# EAGLE design Mega (EAGLE 7.5.0)
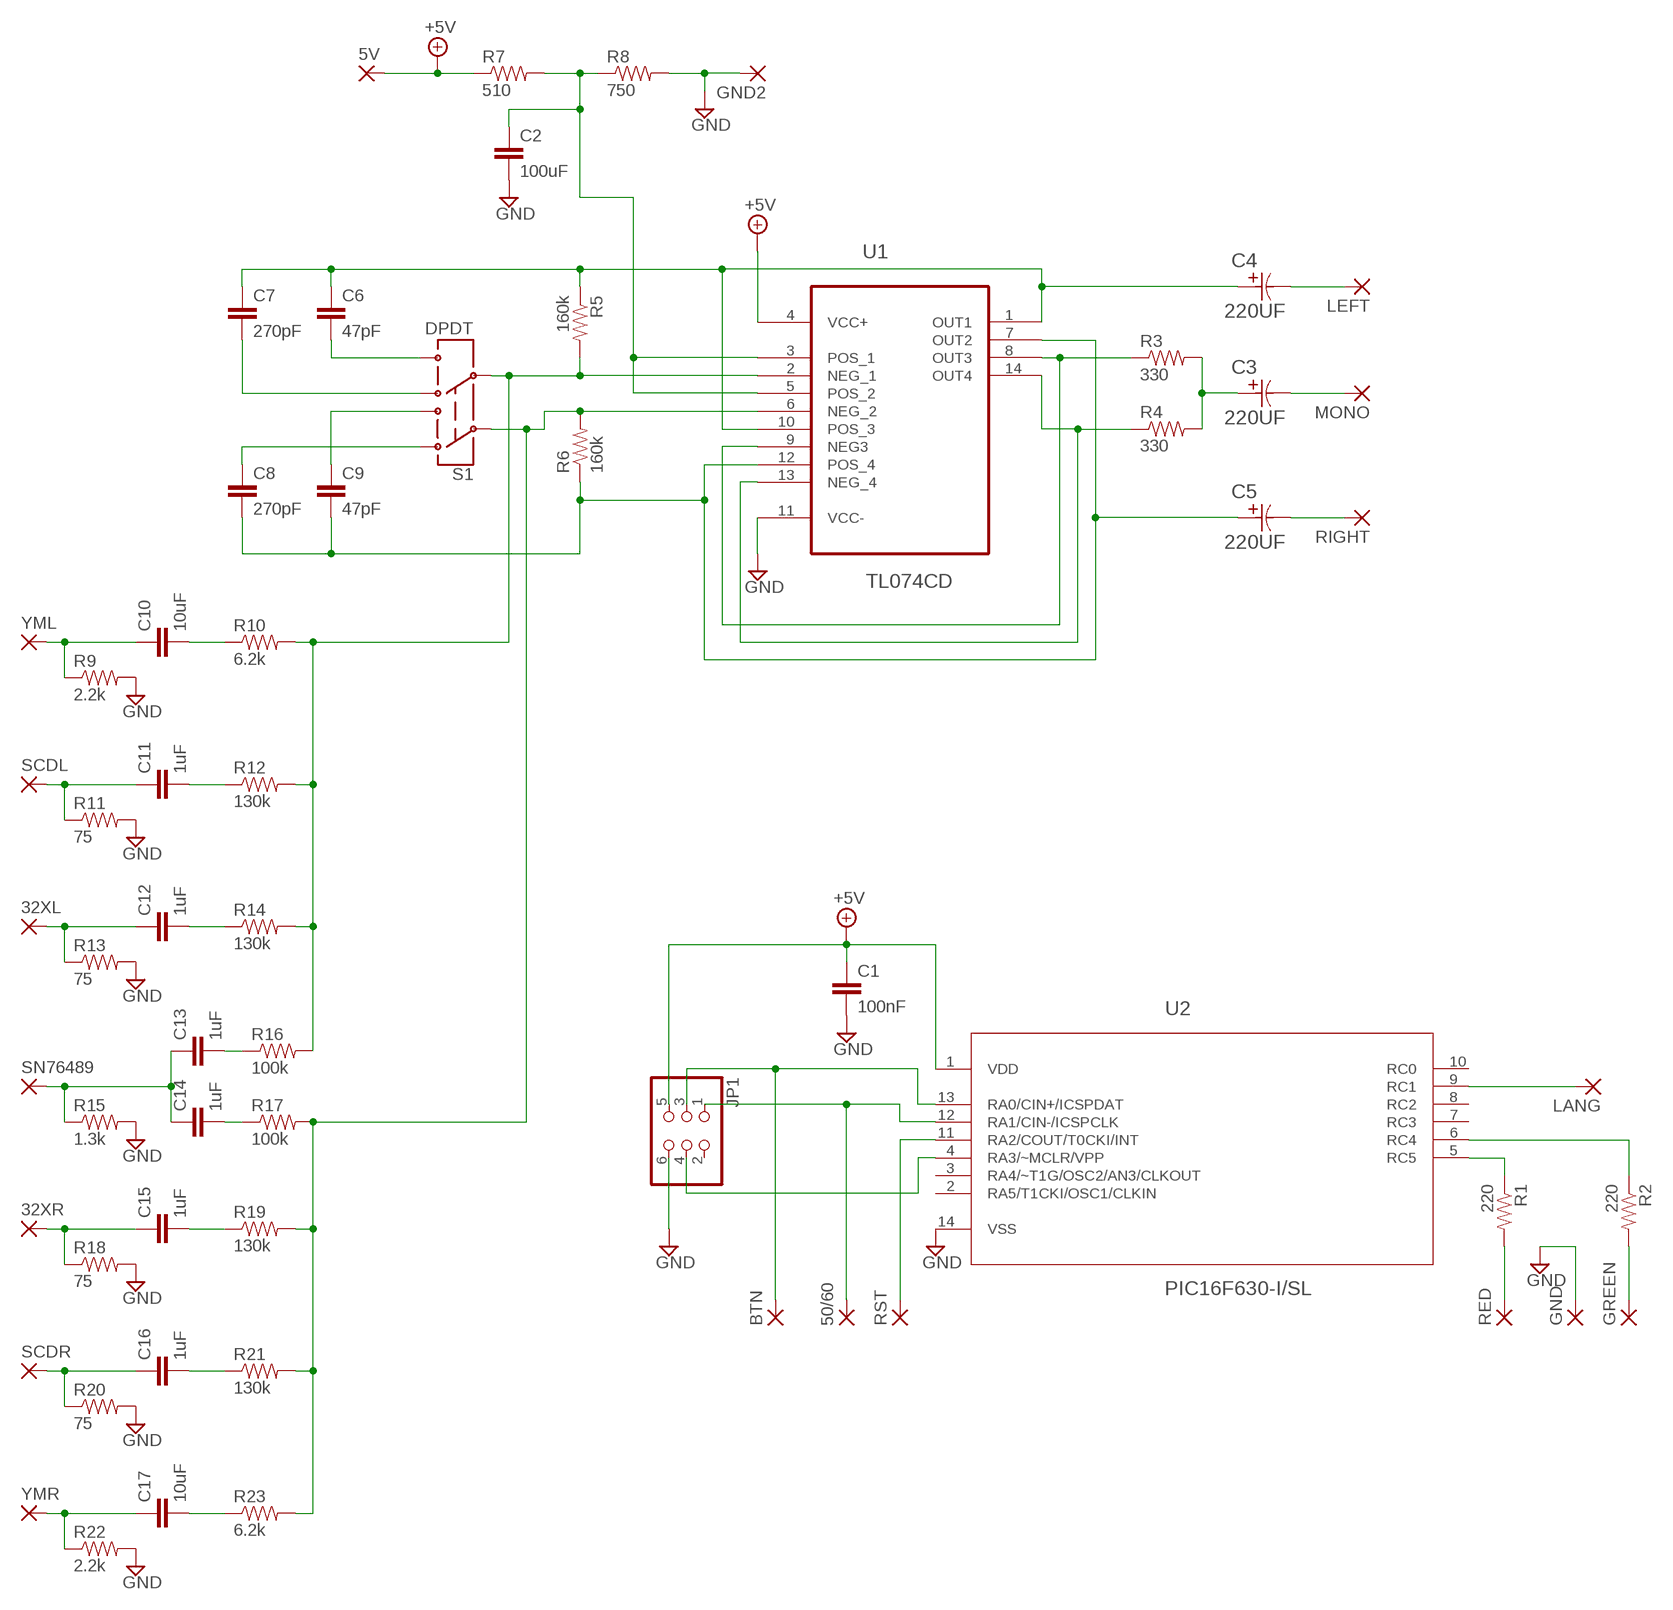
[diagram p0: schematic, sheet 1]

## Parts
5V  SMD2  [SMD1,27-2,54]
32XL  SMD2  [SMD1,27-2,54]
32XR  SMD2  [SMD1,27-2,54]
50/60  SMD2  [SMD1,27-2,54]
BTN  SMD2  [SMD1,27-2,54]
C1  100nF  CAP1206  [1206]
C2  100uF  CAP1206  [1206]
C3  220UF  EEE-FK1C221P-CASE-E  [CAPAE830X650N]
C4  220UF  EEE-FK1C221P-CASE-E  [CAPAE830X650N]
C5  220UF  EEE-FK1C221P-CASE-E  [CAPAE830X650N]
C6  47pF  CAP1206  [1206]
C7  270pF  CAP1206  [1206]
C8  270pF  CAP1206  [1206]
C9  47pF  CAP1206  [1206]
C10  10uF  CAP1206  [1206]
C11  1uF  CAP1206  [1206]
C12  1uF  CAP1206  [1206]
C13  1uF  CAP1206  [1206]
C14  1uF  CAP1206  [1206]
C15  1uF  CAP1206  [1206]
C16  1uF  CAP1206  [1206]
C17  10uF  CAP1206  [1206]
GND  SMD2  [SMD1,27-2,54]
GND2  SMD2  [SMD1,27-2,54]
GREEN  SMD2  [SMD1,27-2,54]
JP1  PINHD-2X3  [2X03]
LANG  SMD2  [SMD1,27-2,54]
LEFT  SMD2  [SMD1,27-2,54]
MONO  SMD2  [SMD1,27-2,54]
R1  220  RESISTOR1206  [1206]
R2  220  RESISTOR1206  [1206]
R3  330  RESISTOR1206  [1206]
R4  330  RESISTOR1206  [1206]
R5  160k  RESISTOR1206  [1206]
R6  160k  RESISTOR1206  [1206]
R7  510  RESISTOR1206  [1206]
R8  750  RESISTOR1206  [1206]
R9  2.2k  RESISTOR1206  [1206]
R10  6.2k  RESISTOR1206  [1206]
R11  75  RESISTOR1206  [1206]
R12  130k  RESISTOR1206  [1206]
R13  75  RESISTOR1206  [1206]
R14  130k  RESISTOR1206  [1206]
R15  1.3k  RESISTOR1206  [1206]
R16  100k  RESISTOR1206  [1206]
R17  100k  RESISTOR1206  [1206]
R18  75  RESISTOR1206  [1206]
R19  130k  RESISTOR1206  [1206]
R20  75  RESISTOR1206  [1206]
R21  130k  RESISTOR1206  [1206]
R22  2.2k  RESISTOR1206  [1206]
R23  6.2k  RESISTOR1206  [1206]
RED  SMD2  [SMD1,27-2,54]
RIGHT  SMD2  [SMD1,27-2,54]
RST  SMD2  [SMD1,27-2,54]
S1  DPDT  SWITCH-DPDTAYZ0202  [AYZ0202]
SCDL  SMD2  [SMD1,27-2,54]
SCDR  SMD2  [SMD1,27-2,54]
SN76489  SMD2  [SMD1,27-2,54]
U1  TL074CD  [SOIC127P600X175-14N]
U2  PIC16F630-I/SL  [SOIC127P600X175-14N]
YML  SMD2  [SMD1,27-2,54]
YMR  SMD2  [SMD1,27-2,54]

## Nets
+5V: 5V.1(P) C1.1 JP1.5 R7.1 U1.4(VCC+) U2.1(VDD)
GND: C1.2 C2.2 GND2.1(P) GND.1(P) JP1.6 R8.2 R9.2 R11.2 R13.2 R15.2 R18.2 R20.2 R22.2 U1.11(VCC-) U2.14(VSS)
N$1: R1.1 U2.5(RC5)
N$2: R2.1 U2.6(RC4)
N$3: R1.2 RED.1(P)
N$4: GREEN.1(P) R2.2
N$5: LANG.1(P) U2.9(RC1)
N$6: JP1.4 U2.4(RA3/~MCLR/VPP)
N$7: RST.1(P) U2.11(RA2/COUT/T0CKI/INT)
N$8: R3.1 U1.8(OUT3) U1.9(NEG3)
N$9: 50/60.1(P) JP1.1 U2.12(RA1/CIN-/ICSPCLK)
N$10: BTN.1(P) JP1.3 U2.13(RA0/CIN+/ICSPDAT)
N$11: R4.1 U1.13(NEG_4) U1.14(OUT4)
N$12: C3.1 R3.2 R4.2
N$13: C3.2 MONO.1(P)
N$14: C4.2 LEFT.1(P)
N$16: C4.1 C6.1 C7.1 R5.1 U1.1(OUT1) U1.10(POS_3)
N$17: C5.1 C8.2 C9.2 R6.1 U1.7(OUT2) U1.12(POS_4)
N$18: C5.2 RIGHT.1(P)
N$19: R6.2 R17.2 R19.2 R21.2 R23.2 S1.2 U1.6(NEG_2)
N$20: C6.2 S1.6
N$21: C7.2 S1.4
N$22: C9.1 S1.3
N$23: C8.1 S1.1
N$24: C10.1 R9.1 YML.1(P)
N$25: C2.1 R7.2 R8.1 U1.3(POS_1) U1.5(POS_2)
N$26: C10.2 R10.1
N$27: C11.1 R11.1 SCDL.1(P)
N$28: C11.2 R12.1
N$29: 32XL.1(P) C12.1 R13.1
N$30: C12.2 R14.1
N$31: C13.1 C14.1 R15.1 SN76489.1(P)
N$32: C13.2 R16.1
N$33: C17.1 R22.1 YMR.1(P)
N$34: C14.2 R17.1
N$35: 32XR.1(P) C15.1 R18.1
N$36: C15.2 R19.1
N$37: C16.1 R20.1 SCDR.1(P)
N$38: C16.2 R21.1
N$39: C17.2 R23.1
N$40: R5.2 R10.2 R12.2 R14.2 R16.2 S1.5 U1.2(NEG_1)
Unconnected: JP1.2 U2.2(RA5/T1CKI/OSC1/CLKIN) U2.3(RA4/~T1G/OSC2/AN3/CLKOUT) U2.7(RC3) U2.8(RC2) U2.10(RC0)

## Library data of the parts
5V 32XL 32XR 50/60 BTN GND GND2 GREEN LANG LEFT MONO RED RIGHT RST SCDL SCDR SN76489 YML YMR = wirepad:SMD2: SMD PAD
C1 C2 C6-C17 = SparkFun-Capacitors:CAP: Capacitor Standard 0603 ceramic capacitor, and 0.1" leaded capacitor.
C3-C5 = 220uF_2106:EEE-: Aluminum Electrolytic Capacitors,Surface Mount Type; MPN: EEE-FK1C221P; OC_FARNELL: 9695680; OC_NEWARK: 96K9382; PACKAGE: CASE-E; SUPPLIER: PANASONIC; TOLERANCE: ±20 %; VOLTAGERATING: 16V
JP1 = SparkFun-Connectors:PINHD-2X3: PIN HEADER
R1-R23 = SparkFun-Resistors:RESISTOR: Resistor Basic schematic elements and footprints for 0603, 1206, and PTH resistors.
S1 = SparkFun-Electromechanical:SWITCH-DPDT: DPDT Version of the COM-00597; PROD_ID: SWCH-08179
U1 = TL074_SMD:TL074CD: Low noise JFET quad operational amplifier; MPN: TL074CD; OC_FARNELL: 1651878; OC_NEWARK: 89K1719; PACKAGE: SOIC-14; SUPPLIER: STMICROELECTRONICS
U2 = 16F630:PIC16F630-I/SL: 8 bit CMOS Microcontrollers; DESCRIPTION: 8 bit CMOS Microcontrollers; MPN: PIC16F630-I/SL; OC_FARNELL: 9760466; OC_NEWARK: 80K6046; PACKAGE: SOIC-14; SUPPLIER: Microchip

## Board
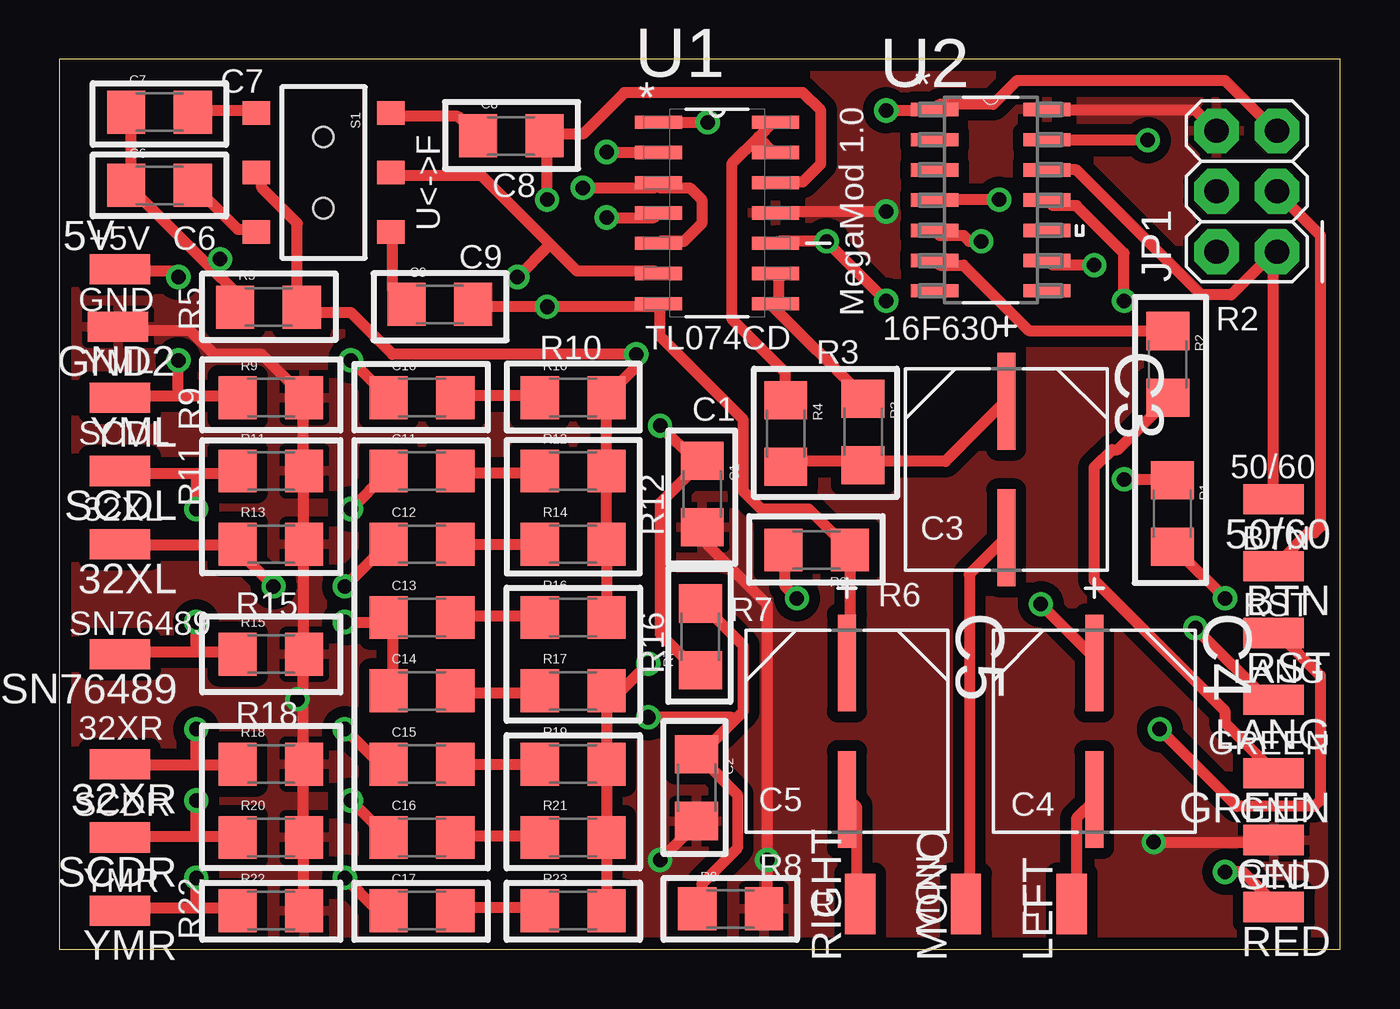
[diagram p1: board, top side]
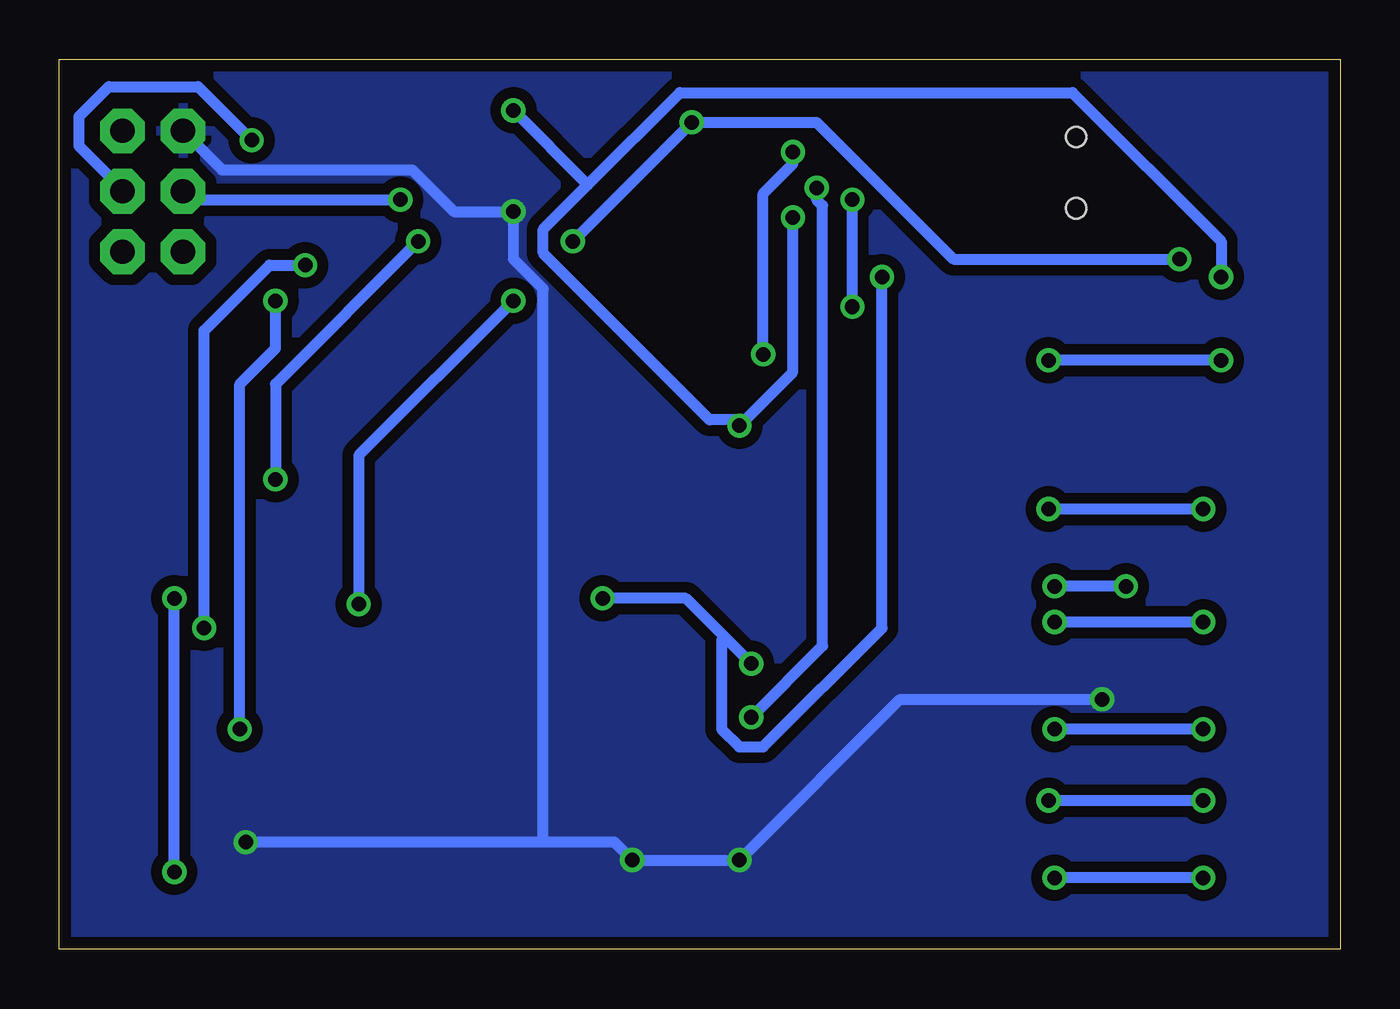
[diagram p2: board, bottom side, seen from below]

Size 53.83 x 37.39 mm. Coordinates in mm from the lower left corner, seen from the top.
Outline: 0,0 53.83,0 53.83,37.39 0,37.39 0,0
Copper layers (1*16): Top 0.035mm / dielectric 1.5mm / Bottom 0.035mm
Design rules "default *": minimum track width 18mil, minimum drill 24mil, track to track 18mil, track to pad 18mil, pad to pad 18mil, via to via 18mil, smd to smd 8mil, copper to edge 20mil, drill to drill 8mil, minimum pad ring 10mil, minimum via ring 8mil, stop-mask expansion 4mil, vias tented up to drill 25mil, thermal gap 10mil

### Footprints (pad centres in the part's own frame; a part is rotated, then mirrored left to right if it is on the bottom)
SMD1,27-2,54 = smd 1.27 x 2.54: 1 0,0
1206 = smd 1.6 x 1.8: 1 -1.4,0; 2 1.4,0
CAPAE830X650N = smd 4.064 x 0.762: 1 -2.87,0; 2 2.87,0
2X03 = drill 1.016 pad 1.88 octagon: 1 -2.54,-1.27; 2 -2.54,1.27; 3 0,-1.27; 4 0,1.27; 5 2.54,-1.27; 6 2.54,1.27
AYZ0202 = smd 1 x 1.15: 1 -2.5,2.825; 2 0,2.825; 3 2.5,2.825; 4 -2.5,-2.825; 5 0,-2.825; 6 2.5,-2.825 | hole 0.85: 1.5,0; -1.5,0
SOIC127P600X175-14N = smd 1.981 x 0.559: 1 -2.464,3.81; 2 -2.464,2.54; 3 -2.464,1.27; 4 -2.464,0; 5 -2.464,-1.27; 6 -2.464,-2.54; 7 -2.464,-3.81; 8 2.464,-3.81; 9 2.464,-2.54; 10 2.464,-1.27; 11 2.464,0; 12 2.464,1.27; 13 2.464,2.54; 14 2.464,3.81
SOIC127P600X175-14N' = smd 1.981 x 0.559: 1 -2.362,3.81; 2 -2.362,2.54; 3 -2.362,1.27; 4 -2.362,0; 5 -2.362,-1.27; 6 -2.362,-2.54; 7 -2.362,-3.81; 8 2.362,-3.81; 9 2.362,-2.54; 10 2.362,-1.27; 11 2.362,0; 12 2.362,1.27; 13 2.362,2.54; 14 2.362,3.81

### Placement (x,y rotation side)
5V  2.54,28.57 270 top
32XL  2.54,17.02 90 top
32XR  2.54,7.78 90 top
50/60  51.04,18.91 90 top
BTN  51.04,16.1 90 top
C1  27.02,19.13 270 top
C2  26.78,6.79 270 top
C3  39.8,20.16 270 top
C4  43.5,9.16 270 top
C5  33.1,9.16 270 top
C6  4.21,32.1 0 top
C7  4.21,35.18 0 top
C8  18.99,34.18 0 top
C9  15.99,27.1 0 top
C10  15.24,23.18 0 top
C11  15.24,20.1 0 top
C12  15.24,17.02 0 top
C13  15.24,13.94 0 top
C14  15.24,10.86 0 top
C15  15.24,7.78 0 top
C16  15.24,4.7 0 top
C17  15.24,1.62 0 top
GND  51.04,4.59 90 top
GND2  2.46,26.16 90 top
GREEN  51.04,7.4 90 top
JP1  49.91,31.85 90 top
LANG  51.04,10.48 90 top
LEFT  42.55,1.91 0 top
MONO  38.1,1.91 0 top
R1  46.78,18.31 270 top
R2  46.59,24.58 270 top
R3  33.78,21.74 270 top
R4  30.53,21.67 270 top
R5  8.79,26.98 0 top
R6  31.83,16.78 180 top
R7  26.94,13.13 90 top
R8  28.21,1.7 0 top
R9  8.89,23.18 0 top
R10  21.59,23.18 0 top
R11  8.89,20.1 0 top
R12  21.59,20.1 0 top
R13  8.89,17.02 0 top
R14  21.59,17.02 0 top
R15  8.89,12.4 0 top
R16  21.59,13.94 0 top
R17  21.59,10.86 0 top
R18  8.89,7.78 0 top
R19  21.59,7.78 0 top
R20  8.89,4.7 0 top
R21  21.59,4.7 0 top
R22  8.89,1.62 0 top
R23  21.59,1.62 0 top
RED  51.04,1.78 90 top
RIGHT  33.66,1.91 0 top
RST  51.04,13.29 90 top
S1  11.1,32.64 270 top
SCDL  2.54,20.1 90 top
SCDR  2.54,4.7 90 top
SN76489  2.54,12.4 90 top
U1  27.64,30.94 0 top
U2  PIC16F630-I/SL  [SOIC127P600X175-14N']  39.15,31.48 0 top
YML  2.54,23.18 90 top
YMR  2.54,1.62 90 top

### Tracks (layer width: path | path; a pad name or v marks a point on that pad's centre or on a via)
+5V  (via drill 0.61)
  Top 0.457: JP1.5 51,34.5 49,36.5 40.25,36.5 39.25,35.5 37,35.5 U2.1 36.75,35.25 v34.75,35.25 | R7.1 26.75,11.75 25.25,13.25 25.25,18.75 27,20.5 C1.1 26.75,20.5 v25.25,22 | v23,30.75 25,30.75 U1.4 | v5,28.25 4.75,28.5 2.75,28.5 5V.1
  Bottom 0.457: v23,30.75 23,24.25 v25.25,22 25.25,22.25 26.5,22.25 33.5,29.25 33.5,30.25 31.62,32.12 | v5,28.25 5,29.75 11.25,36 27.75,36 31.62,32.12 | 31.62,32.12 v34.75,35.25
GND  (via drill 0.61)
  Top 0.457: R22.2 10.25,1.75 10.25,4.5 R20.2 10.25,4.75 10.25,7.75 R18.2 10.25,8 10.25,10.5 | 10.25,10.5 10.25,12.25 R15.2 10.25,12.5 10.25,17 R13.2 10.25,17.25 10.25,20 R11.2 10.25,20.25 10.25,23 R9.2 10.25,23.25 8.5,25 6.5,25 5.5,26 2.5,26 GND2.1 | v34.75,31 30.25,31 U1.11 | U2.14 41.75,35.25 47.75,35.25 48.5,34.5 JP1.6 | R8.2 29.75,1.75 v29.75,3.75 29.75,14.5 27.25,17 27.25,17.5 C1.2 | v25.25,3.75 26.75,5.25 C2.2 | v46,4.5 51,4.5 GND.1 | v10,10.5 10.25,10.5
  Bottom 0.457: JP1.6 47,32.75 39,32.75 37.25,31 v34.75,31 34.75,29 33.5,27.75 33.5,4.5 | 33.5,4.5 30.5,4.5 v29.75,3.75 v25.25,3.75 18.5,10.5 v10,10.5 | 33.5,4.5 v46,4.5
  pour Bottom: 0,0 0,38 54,38 54,37 54,0
  pour Top: 0,0 0,38 54,38 54,0
N$1  (via drill 0.61)
  Top 0.457: v44.75,19.75 46.75,19.75 R1.1 | v38.75,29.75 38.25,29.75 38,30 37,30 U2.5
  Bottom 0.457: v44.75,19.75 44.75,23.75 v38.75,29.75
N$2
  Top 0.457: R2.1 46.5,26 40.75,26 38,28.75 37,28.75 U2.6
N$3  (via drill 0.61)
  Top 0.457: v49,14.75 47,16.75 R1.2 | v49,3.25 49.75,3.25 51,2 RED.1
  Bottom 0.457: v49,3.25 v49,14.75
N$4
  Top 0.457: R2.2 46.5,23 44.5,21 44.25,21 43.5,20.25 43.5,15.5 49,10 49,9.5 51,7.5 GREEN.1
N$5  (via drill 0.61)
  Top 0.457: v43.5,28.75 41.75,28.75 U2.9 | v47.75,13.5 51,10.25 LANG.1
  Bottom 0.457: v43.5,28.75 45,28.75 47.75,26 v47.75,13.5
N$6  (via drill 0.61)
  Top 0.457: v39.5,31.5 37,31.5 U2.4
  Bottom 0.457: v39.5,31.5 48.25,31.5 48.5,31.75 JP1.4
N$7  (via drill 0.61)
  Top 0.457: v44.75,27.25 44.75,29.25 42.75,31.25 41.75,31.25 U2.11 | v46.25,9.25 49.5,6 52.75,6 53,6.25 53,11.5 51.25,13.25 RST.1
  Bottom 0.457: v44.75,27.25 44.75,25.25 46.25,23.75 v46.25,9.25
N$8
  Top 0.457: R3.1 33.75,23.25 30,27 U1.8 30.25,27.25 30.25,28.25 U1.9
N$9
  Top 0.457: U2.12 42.75,32.75 48,27.5 49.25,27.5 51,29.25 JP1.1 51,29 51,19 50/60.1
N$10  (via drill 0.61)
  Top 0.457: v45.75,34 41.75,34 U2.13 | BTN.1 51.25,16.25 52.5,17.5 52.75,17.5 53,17.75 53,30 51.25,31.75 JP1.3
  Bottom 0.457: v45.75,34 48,36.25 51.75,36.25 53,35 53,33.75 51.25,32 JP1.3
N$11
  Top 0.457: 29.38,34.12 30,34.75 U1.14 | 29.38,34.12 28.25,33 28.25,26.5 30.5,24.25 30.5,23.25 R4.1 | 29.38,34.12 30,33.5 U1.13
N$12
  Top 0.457: R4.2 30.75,20.5 33.75,20.5 R3.2 34,20.5 37.25,20.5 39.75,23 C3.1
N$13
  Top 0.457: MONO.1 38.25,2 38.25,15.75 39.75,17.25 C3.2
N$14
  Top 0.457: LEFT.1 42.75,2 42.75,5.5 43.5,6.25 C4.2
N$16  (via drill 0.61)
  Top 0.457: C7.1 3,35 3,32.25 C6.1 3,32 6.38,28.62 | 6.38,28.62 7.25,27.75 7.25,27 R5.1 | U1.1 v27.25,34.75 | U1.10 30.25,29.75 v32.25,29.75 v34.75,27.25 | v41.25,14.5 43.5,12.25 C4.1 | v6.75,29 6.38,28.62
  Bottom 0.457: v32.25,29.75 v27.25,34.75 22,34.75 16.25,29 v6.75,29 | v41.25,14.5 41.25,20.75 v34.75,27.25
N$17  (via drill 0.61)
  Top 0.457: U1.12 30.25,32.25 31.25,32.25 32,33 32,35.25 31.25,36 23.75,36 22,34.25 20.5,34.25 C8.2 20.5,34 v20.5,31.5 | C9.2 17.5,27 v20.5,27 25,27 U1.7 25.25,27 25.25,25.75 28.75,22.25 28.75,19.25 29.5,18.5 31.5,18.5 33,17 R6.1 33.25,16.75 33.25,12.25 C5.1
  Bottom 0.457: v20.5,27 v20.5,31.5
N$18
  Top 0.457: RIGHT.1 33.5,2 33.5,6 33.25,6.25 C5.2
N$19  (via drill 0.61)
  Top 0.457: 20.62,29.62 21.75,28.5 25,28.5 U1.6 | 20.62,29.62 17.75,32.5 14,32.5 S1.2 | R23.2 23,1.75 23,4.5 R21.2 23,4.75 23,7.75 R19.2 23,8 23,10.25 | 23,10.25 23,10.75 R17.2 23,10.25 | v31,14.75 30.5,15.25 30.5,16.75 R6.2 | 23,10.25 v24.75,12 | v19.25,28.25 20.62,29.62
  Bottom 0.457: v31,14.75 27.5,14.75 25.88,13.12 | v24.75,12 25.88,13.12 | v19.25,28.25 19.25,13.5 24.25,8.5 25.25,8.5 26,9.25 26,13 25.88,13.12
N$20
  Top 0.457: S1.6 8.25,30.25 7.5,30.25 5.75,32 C6.2
N$21
  Top 0.457: S1.4 8.25,35.25 5.75,35.25 C7.2
N$22
  Top 0.457: S1.3 14,30 14,27.75 14.5,27.25 C9.1
N$23
  Top 0.457: S1.1 14,35 16.75,35 17.5,34.25 C8.1
N$24  (via drill 0.61)
  Top 0.457: 5,23.25 2.75,23.25 YML.1 | 5,23.25 7.25,23.25 R9.1 | v12.25,24.75 13.75,23.25 C10.1 | 5,23.25 v5,24.75
  Bottom 0.457: v5,24.75 v12.25,24.75
N$25  (via drill 0.61)
  Top 0.457: U1.5 25.25,29.75 26.25,29.75 27,30.5 27,31.5 26.5,32 25.25,32 U1.3 25,32 v22,32 | R8.1 27,1.75 27,2.75 28.5,4.25 28.5,6.5 27,8 C2.1 27,8.25 28.38,9.62 | 28.38,9.62 28.75,10 28.75,12.75 27,14.5 R7.2 | v24.75,9.75 28.25,9.75 28.38,9.62
  Bottom 0.457: v22,32 22,31.5 21.75,31.25 21.75,12.75 v24.75,9.75
N$26
  Top 0.457: C10.2 16.75,23.25 20,23.25 R10.1
N$27  (via drill 0.61)
  Top 0.457: 5.75,20 2.75,20 SCDL.1 | 5.75,20 7.25,20 R11.1 | v12.25,18.5 13.75,20 C11.1 | 5.75,20 v5.75,18.5
  Bottom 0.457: v5.75,18.5 v12.25,18.5
N$28
  Top 0.457: C11.2 16.75,20 20,20 R12.1
N$29  (via drill 0.61)
  Top 0.457: 7.25,17 2.75,17 32XL.1 | v12,15.25 13.75,17 C12.1 | 7.25,17 v9,15.25 | 7.25,17 R13.1
  Bottom 0.457: v9,15.25 v12,15.25
N$30
  Top 0.457: C12.2 16.75,17 20,17 R14.1
N$31  (via drill 0.61)
  Top 0.457: C14.1 14,11 14,13.75 C13.1 13.75,13.75 v12,13.75 | 5.75,12.5 2.75,12.5 SN76489.1 | 5.75,12.5 7.25,12.5 R15.1 | 5.75,12.5 v5.75,13.75
  Bottom 0.457: v5.75,13.75 v12,13.75
N$32
  Top 0.457: C13.2 16.75,14 20,14 R16.1
N$33  (via drill 0.61)
  Top 0.457: 5.75,1.75 2.75,1.75 YMR.1 | 5.75,1.75 7.25,1.75 R22.1 | v12,3 13.25,1.75 13.75,1.75 C17.1 | 5.75,1.75 v5.75,3
  Bottom 0.457: v5.75,3 v12,3
N$34
  Top 0.457: C14.2 16.75,10.75 20,10.75 R17.1
N$35  (via drill 0.61)
  Top 0.457: 5.75,7.75 2.75,7.75 32XR.1 | 5.75,7.75 7.25,7.75 R18.1 | v12,9.25 13.25,8 13.75,8 C15.1 | 5.75,7.75 v5.75,9.25
  Bottom 0.457: v5.75,9.25 v12,9.25
N$36
  Top 0.457: C15.2 16.75,7.75 20,7.75 R19.1
N$37  (via drill 0.61)
  Top 0.457: 5.75,4.75 2.75,4.75 SCDR.1 | 5.75,4.75 7.25,4.75 R20.1 | v12.25,6.25 13.75,4.75 C16.1 | 5.75,4.75 v5.75,6.25
  Bottom 0.457: v5.75,6.25 v12.25,6.25
N$38
  Top 0.457: C16.2 16.75,4.75 20,4.75 R21.1
N$39
  Top 0.457: C17.2 16.75,1.75 20,1.75 R23.1
N$40  (via drill 0.61)
  Top 0.457: S1.5 8.5,32.5 8.5,32 10,30.5 10,27 R5.2 10.25,26.75 12.25,26.75 14,25 v24.25,25 24.25,24.5 23,23.25 R10.2 23,23 23,20.25 R12.2 23,20 23,17.25 R14.2 23,17 23,14 R16.2 | v23,33.5 25,33.5 U1.2
  Bottom 0.457: v23,33.5 23,33 24.25,31.75 v24.25,25

### Text on the board
tPlace: C7 | C8 | +5V | C6 | U<->F | C9 | GND | MegaMod 1.0 | R5 | R10 | 16F630 | R2 | TL074CD | R3 | YML | R9 | C1 | SCDL | 50/60 | R12 | R11 | 32XL | BTN | C3 | R7 | RST | R15 | R16 | R6 | SN76489 | LANG | 32XR | R18 | GREEN | SCDR | C5 | C4 | GND | RED | R8 | YMR | L | R | MON | R22